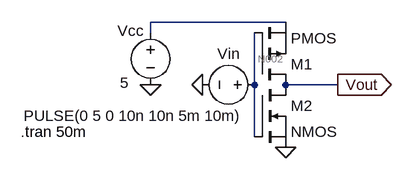
[diagram p0: schematic cmos_not.asc]
cmos_not.asc, the LTspice schematic file:
Version 4.1
SHEET 1 880 680
WIRE 208 96 0 96
WIRE 0 112 0 96
WIRE 160 192 160 112
WIRE 288 192 208 192
WIRE 160 272 160 192
FLAG 80 192 0
FLAG 0 192 0
FLAG 288 192 Vout
IOPIN 288 192 Out
FLAG 208 288 0
SYMBOL pmos 160 192 M180
SYMATTR InstName M1
SYMBOL nmos 160 192 R0
SYMATTR InstName M2
SYMBOL voltage 176 192 R90
WINDOW 0 -32 56 VBottom 2
WINDOW 3 32 203 VTop 2
WINDOW 123 0 0 Left 0
WINDOW 39 0 0 Left 0
SYMATTR InstName Vin
SYMATTR Value PULSE(0 5 0 10n 10n 5m 10m)
SYMBOL voltage 0 96 R0
WINDOW 0 -51 13 Left 2
WINDOW 3 -47 93 Left 2
SYMATTR InstName Vcc
SYMATTR Value 5
TEXT -200 264 Left 2 !.tran 50m

The netlist it stands for:
* cmos_not.asc
M1 Vout N002 N001 N001 PMOS
M2 Vout N002 0 0 NMOS
Vin N002 0 PULSE(0 5 0 10n 10n 5m 10m)
Vcc N001 0 5
.model NMOS NMOS
.model PMOS PMOS
.lib standard.mos
.tran 50m
.backanno
.end

* Results of the author's LTspice run, read from the files saved beside the schematic
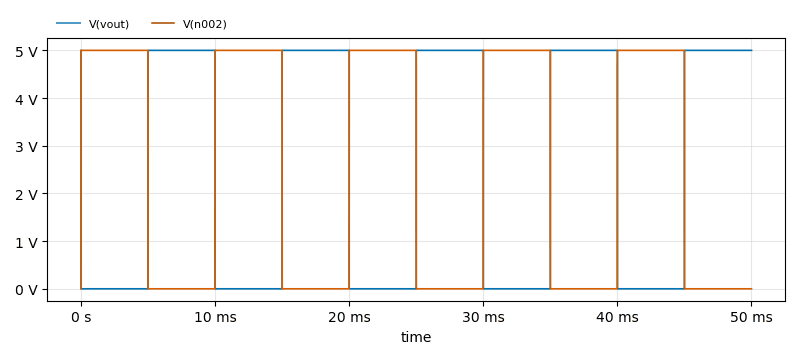
[diagram p1: Transient Analysis of cmos_not.asc, plotted from the saved traces]
* Transient Analysis, 1 run:
*   V(vout): min 0 V, max 5 V, average 2.5 V, rms 3.536 V, last 5 V
*   V(n002): min 0 V, max 5 V, average 2.5 V, rms 3.536 V, last 0 V